# Altium schematic sheet Drivers_main.SchDoc
size A4 portrait; SheetNumber: 1; SheetTotal: 2
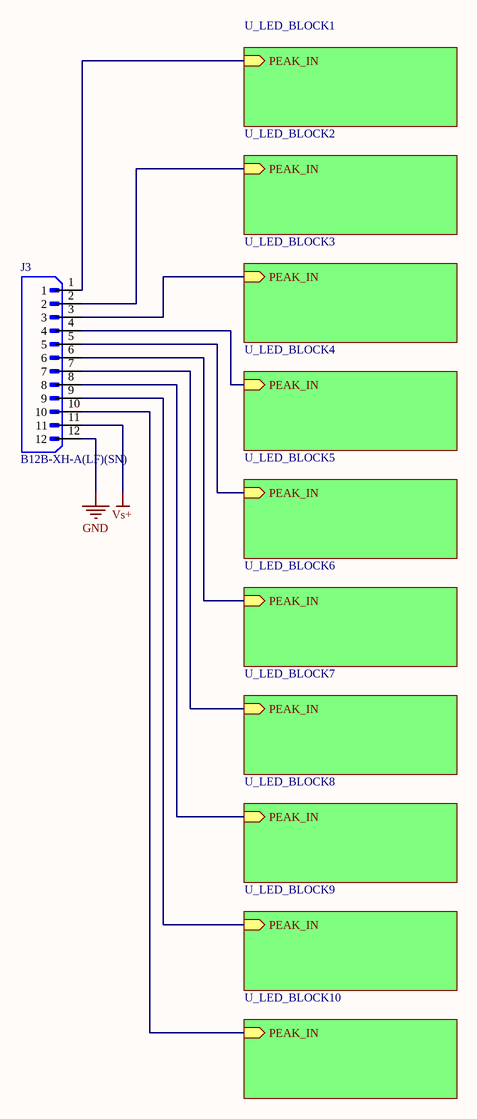
[diagram p0: Drivers_main.SchDoc]

## Parts
J3  B12B-XH-A(LF)(SN)  [JST_B12B-XH-A(LF)(SN)]

## Sub-sheets
U_LED_BLOCK1 = LED_BLOCK.SchDoc: PEAK_IN (in)
U_LED_BLOCK2 = LED_BLOCK.SchDoc: PEAK_IN (in)
U_LED_BLOCK3 = LED_BLOCK.SchDoc: PEAK_IN (in)
U_LED_BLOCK4 = LED_BLOCK.SchDoc: PEAK_IN (in)
U_LED_BLOCK5 = LED_BLOCK.SchDoc: PEAK_IN (in)
U_LED_BLOCK6 = LED_BLOCK.SchDoc: PEAK_IN (in)
U_LED_BLOCK7 = LED_BLOCK.SchDoc: PEAK_IN (in)
U_LED_BLOCK8 = LED_BLOCK.SchDoc: PEAK_IN (in)
U_LED_BLOCK9 = LED_BLOCK.SchDoc: PEAK_IN (in)
U_LED_BLOCK10 = LED_BLOCK.SchDoc: PEAK_IN (in)

## Nets
GND: J3.12
Vs+: J3.11
NetJ3_1: J3.1 ; sheet U_LED_BLOCK1/PEAK_IN
NetJ3_2: J3.2 ; sheet U_LED_BLOCK2/PEAK_IN
NetJ3_3: J3.3 ; sheet U_LED_BLOCK3/PEAK_IN
NetJ3_4: J3.4 ; sheet U_LED_BLOCK4/PEAK_IN
NetJ3_5: J3.5 ; sheet U_LED_BLOCK5/PEAK_IN
NetJ3_6: J3.6 ; sheet U_LED_BLOCK6/PEAK_IN
NetJ3_7: J3.7 ; sheet U_LED_BLOCK7/PEAK_IN
NetJ3_8: J3.8 ; sheet U_LED_BLOCK8/PEAK_IN
NetJ3_9: J3.9 ; sheet U_LED_BLOCK9/PEAK_IN
NetJ3_10: J3.10 ; sheet U_LED_BLOCK10/PEAK_IN

## Library data of the parts
J3 = B12B-XH-A(LF)(SN): Connector Header Through Hole 12 position 0.098 (2.50mm); MF: JST Sales; SnapEDA_Link: https://www.snapeda.com/parts/B12B-XH-A(LF)(SN)/JST+Sales+America+Inc./view-part/?ref=snap; Package: None; Value: *; MP: B12B-XH-A(LF)(SN); Check_prices: https://www.snapeda.com/parts/B12B-XH-A(LF)(SN)/JST+Sales+America+Inc./view-part/?ref=eda